# Altium schematic sheet Temp Bank.SchDoc
size A3; SheetNumber: 5; SheetTotal: 5
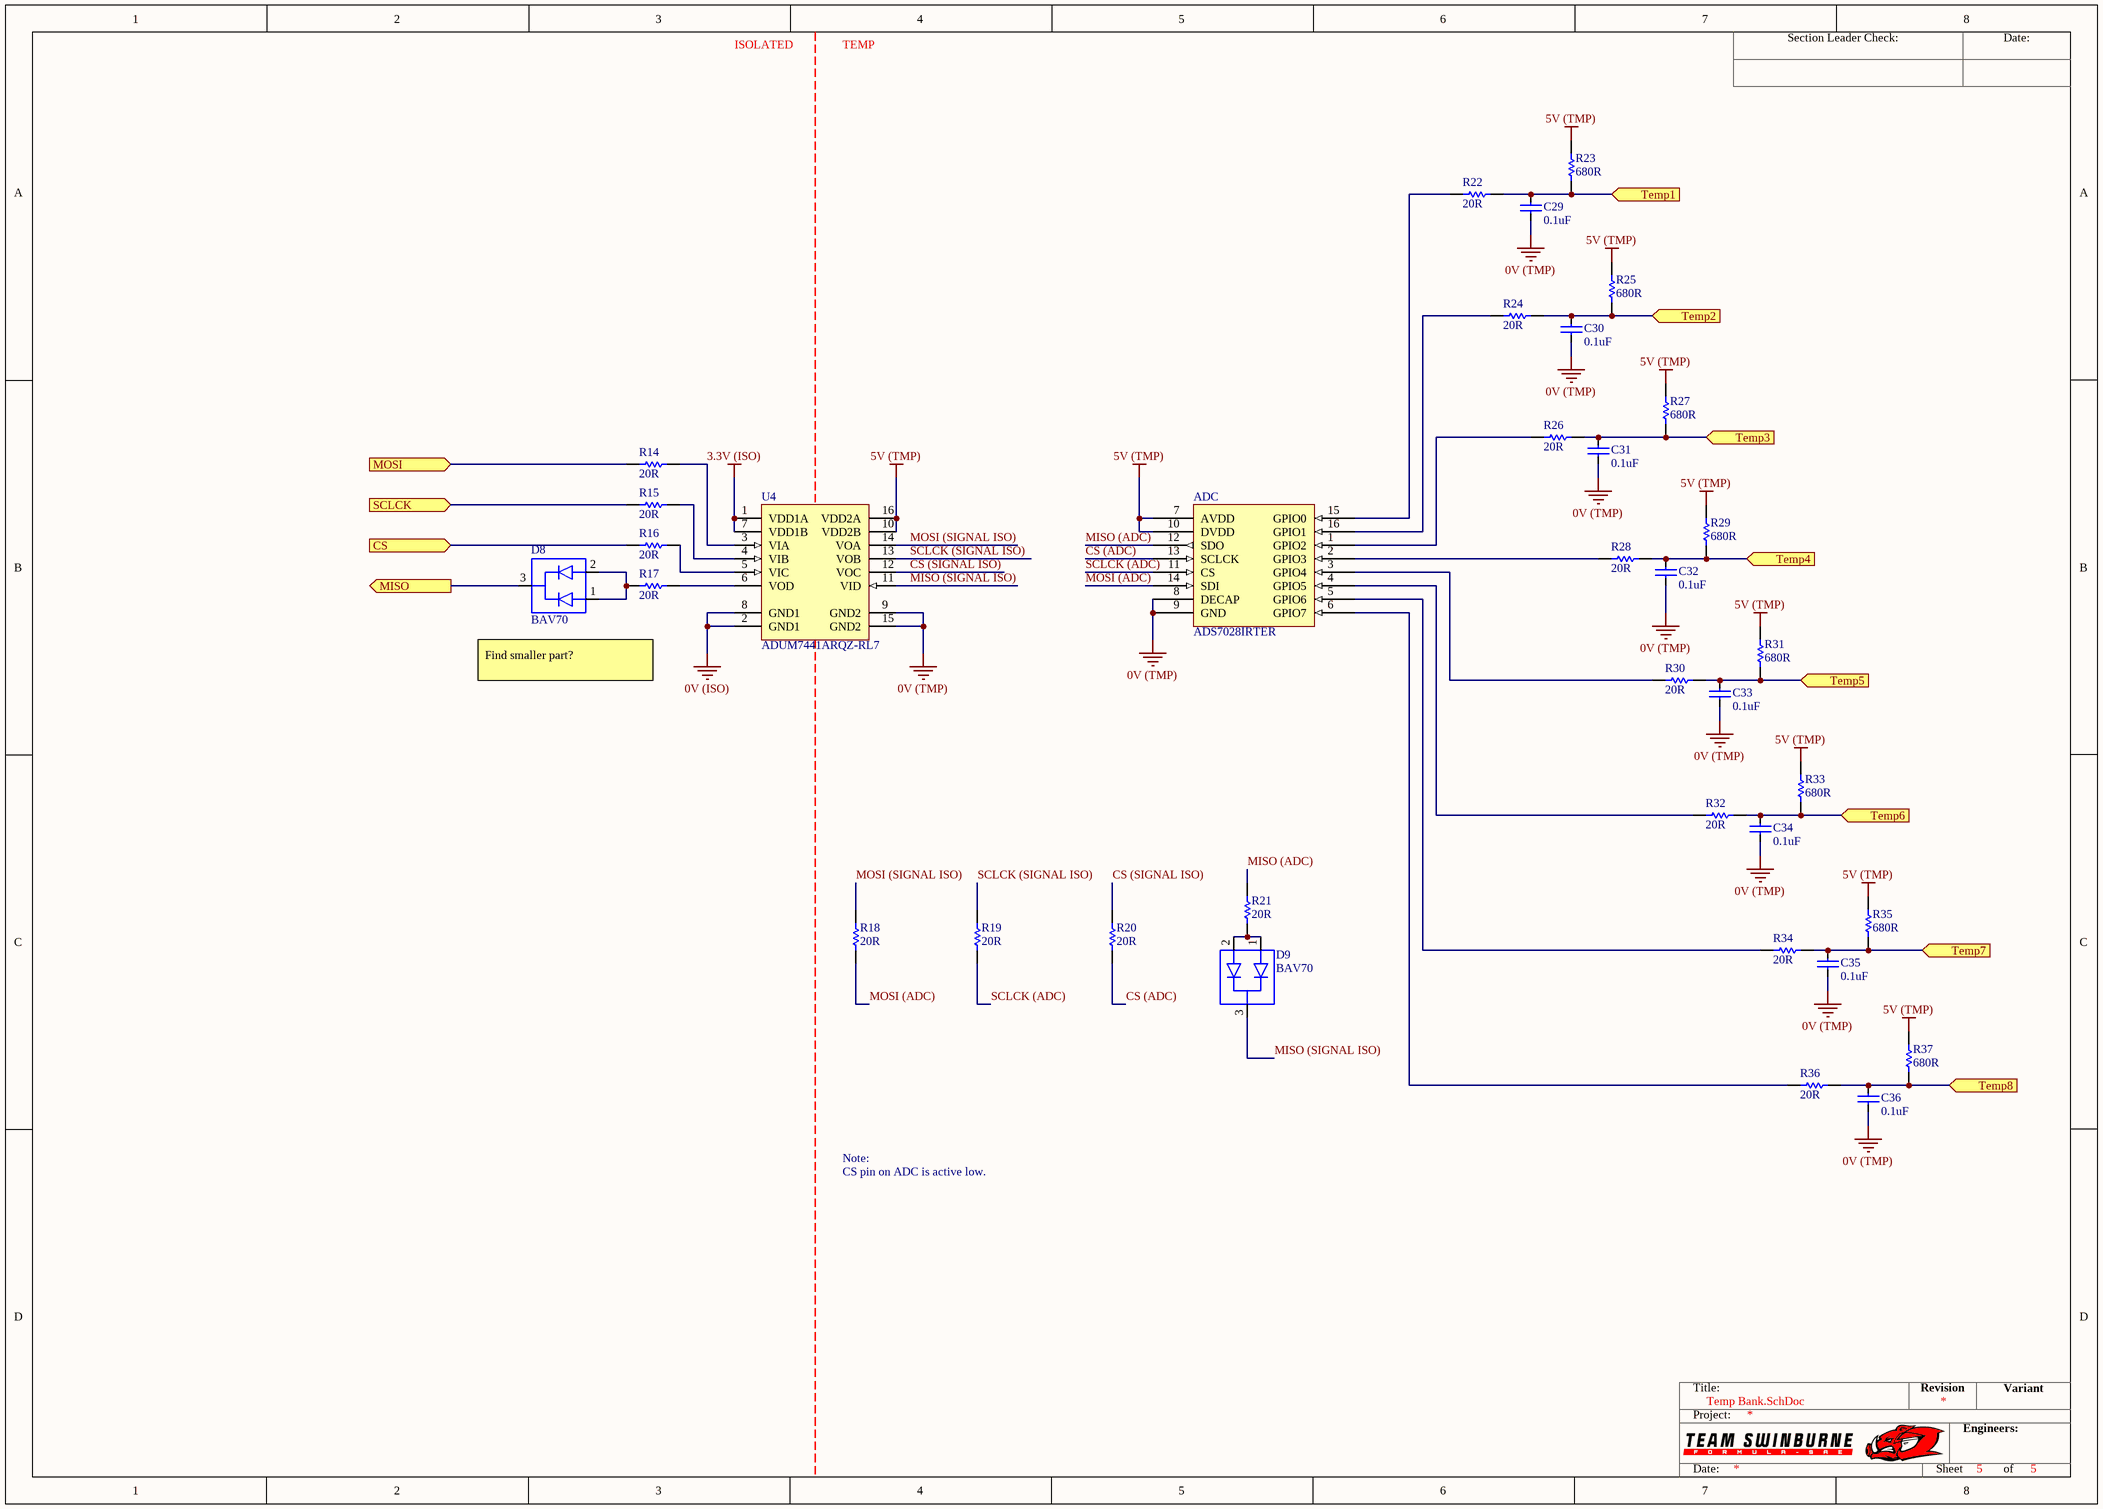
[diagram p0: Temp Bank.SchDoc]

## Parts
ADC  ADS7028IRTER  [QFN50P300X300X80_HS-17N]
C29  0.1uF  [0805]
C30  0.1uF  [0805]
C31  0.1uF  [0805]
C32  0.1uF  [0805]
C33  0.1uF  [0805]
C34  0.1uF  [0805]
C35  0.1uF  [0805]
C36  0.1uF  [0805]
D8  BAV70  [BAV70-Footprint-1]
D9  BAV70  [BAV70-Footprint-1]
R14  20R  [RESC0603]
R15  20R  [RESC0603]
R16  20R  [RESC0603]
R17  20R  [RESC0603]
R18  20R  [RESC0603]
R19  20R  [RESC0603]
R20  20R  [RESC0603]
R21  20R  [RESC0603]
R22  20R  [RESC0603]
R23  680R  [0805]
R24  20R  [RESC0603]
R25  680R  [0805]
R26  20R  [RESC0603]
R27  680R  [0805]
R28  20R  [RESC0603]
R29  680R  [0805]
R30  20R  [RESC0603]
R31  680R  [0805]
R32  20R  [RESC0603]
R33  680R  [0805]
R34  20R  [RESC0603]
R35  680R  [0805]
R36  20R  [RESC0603]
R37  680R  [0805]
U4  ADUM7441ARQZ-RL7  [ADI-RQ-16_M]

## Ports
CS (in), MISO (out), MOSI (in), SCLCK (in), Temp1 (in), Temp2 (in), Temp3 (in), Temp4 (in), Temp5 (in), Temp6 (in), Temp7 (in), Temp8 (in)

## Nets
0V (ISO): U4.2(GND1) U4.8(GND1)
0V (TMP): ADC.8(DECAP) ADC.9(GND) C29.2 C30.2 C31.2 C32.2 C33.2 C34.2 C35.2 C36.2 U4.9(GND2) U4.15(GND2)
3.3V (ISO): U4.1(VDD1A) U4.7(VDD1B)
5V (TMP): ADC.7(AVDD) ADC.10(DVDD) R23.2 R25.2 R27.2 R29.2 R31.2 R33.2 R35.2 R37.2 U4.10(VDD2B) U4.16(VDD2A)
CS: R16.1 ; port CS
CS (ADC): ADC.13(SCLCK) R20.1
CS (SIGNAL ISO): R20.2 U4.12(VOC)
MISO: D8.3(CC) ; port MISO
MISO (ADC): ADC.12(SDO) R21.2
MISO (SIGNAL ISO): D9.3(CC) U4.11(VID)
MOSI: R14.1 ; port MOSI
MOSI (ADC): ADC.14(SDI) R18.1
MOSI (SIGNAL ISO): R18.2 U4.14(VOA)
SCLCK: R15.1 ; port SCLCK
SCLCK (ADC): ADC.11(CS) R19.1
SCLCK (SIGNAL ISO): R19.2 U4.13(VOB)
Temp1: C29.1 R22.2 R23.1 ; port Temp1
Temp2: C30.1 R24.2 R25.1 ; port Temp2
Temp3: C31.1 R26.2 R27.1 ; port Temp3
Temp4: C32.1 R28.2 R29.1 ; port Temp4
Temp5: C33.1 R30.2 R31.1 ; port Temp5
Temp6: C34.1 R32.2 R33.1 ; port Temp6
Temp7: C35.1 R34.2 R35.1 ; port Temp7
Temp8: C36.1 R36.2 R37.1 ; port Temp8
NetADC_1: ADC.1(GPIO2) R26.1
NetADC_2: ADC.2(GPIO3) R28.1
NetADC_3: ADC.3(GPIO4) R30.1
NetADC_4: ADC.4(GPIO5) R32.1
NetADC_5: ADC.5(GPIO6) R34.1
NetADC_6: ADC.6(GPIO7) R36.1
NetADC_15: ADC.15(GPIO0) R22.1
NetADC_16: ADC.16(GPIO1) R24.1
NetD8_1: D8.1(A1) D8.2(A2) R17.1
NetD9_1: D9.1(A1) D9.2(A2) R21.1
NetR14_2: R14.2 U4.3(VIA)
NetR15_2: R15.2 U4.4(VIB)
NetR16_2: R16.2 U4.5(VIC)
NetR17_2: R17.2 U4.6(VOD)

## Notes on the sheet
- ISOLATED
- TEMP
- Find smaller part?
- Note:
- CS pin on ADC is active low.
- Section Leader Check:
- Date:
- Title:
- Revision
- Variant
- Project:
- Engineers:
- Sheet
- of

## Library data of the parts
ADC = CMP-001-0002-8: Small 8-channel 12-bit analog-to-digital converter (ADC) with SPI, GPIOs and CRC 16-WQFN -40 to 85
C29-C36 = CMP-00018-1: Cap Ceramic 0.1uF 25V X7R 10% Pad SMD 0805 125C Automotive T/R; Capacitance: 100nF; Max Operating Temperature: 125°C; RoHS Compliant: Yes; Series: GCM; Case Code (Metric): 2012; Thickness: 0.055inch; Depth: 1.25mm; Width: 1.25mm; Package Quantity: 3000; Case Code (Imperial): 0805; Voltage Rating (DC): 25V; Dielectric: X7R; Construction: Flat; Height: 1.25mm; Ratings: AEC-Q200; Mount: Surface Mount; Voltage Rating: 25V; Tolerance: 10%; Length: 2mm; Case/Package: 0805; Packaging: Tape and Reel; Min Operating Temperature: -55°C; Radiation Hardening: No; Termination: SMD/SMT
D8 D9 = CMP-004-00001-1: DIODE ARRAY GP 70V 200mA SOT23-3; RoHS Compliant: No
R14-R22 R24 R26 R28 R30 R32 R34 R36 = CMP-RES-0043-1: RES SMD 20 OHM JUMPER 1/10W 0603; Voltage Rating: 50V; Tolerance: 1%; Power Rating: 100mW; Case/Package: 0603; Min Operating Temperature: -55°C; Max Operating Temperature: 155°C
R23 R25 R27 R29 R31 R33 R35 R37 = CMP-037-000298-3: RC0805FR07680RL; Rated Voltage: 0.125W; Tolerance: 0.01; Material: FR-07; Digikey Part Number: 311-680CRCT-ND; Value: 680R
U4 = CMP-001-0005-5: Digital Isolator CMOS 4-CH 1Mbps 16-Pin QSOP T/R; Pulse Width Distortion (PWD): 25ns; Nominal Supply Current: 4.1mA; Data Rate: 25Mbps; Turn-On Delay Time: 56ns; Max Supply Voltage: 5.5V; Isolated Power: No; Min Supply Voltage: 3V; Propagation Delay: 75ns; Channel Type: Unidirectional; Number of Channels: 4; Lead Free: Contains Lead; Number of Pins: 16; Contact Plating: Tin,Matte; RoHS Compliant: Yes; Package Quantity: 1000; Type: General Purpose; Supply Current: 4.1mA; Case/Package: QSOP; Max Operating Temperature: 105°C; Packaging: Tape and Reel; Series: iCoupler®; Min Operating Temperature: -40°C